# Altium schematic sheet PROB_S7CAS_FPGA_B35.SchDoc
size Tabloid; SheetNumber: 6; SheetTotal: 14; Sheet_Name: Insert name in Document Parameters; Size: 11x17
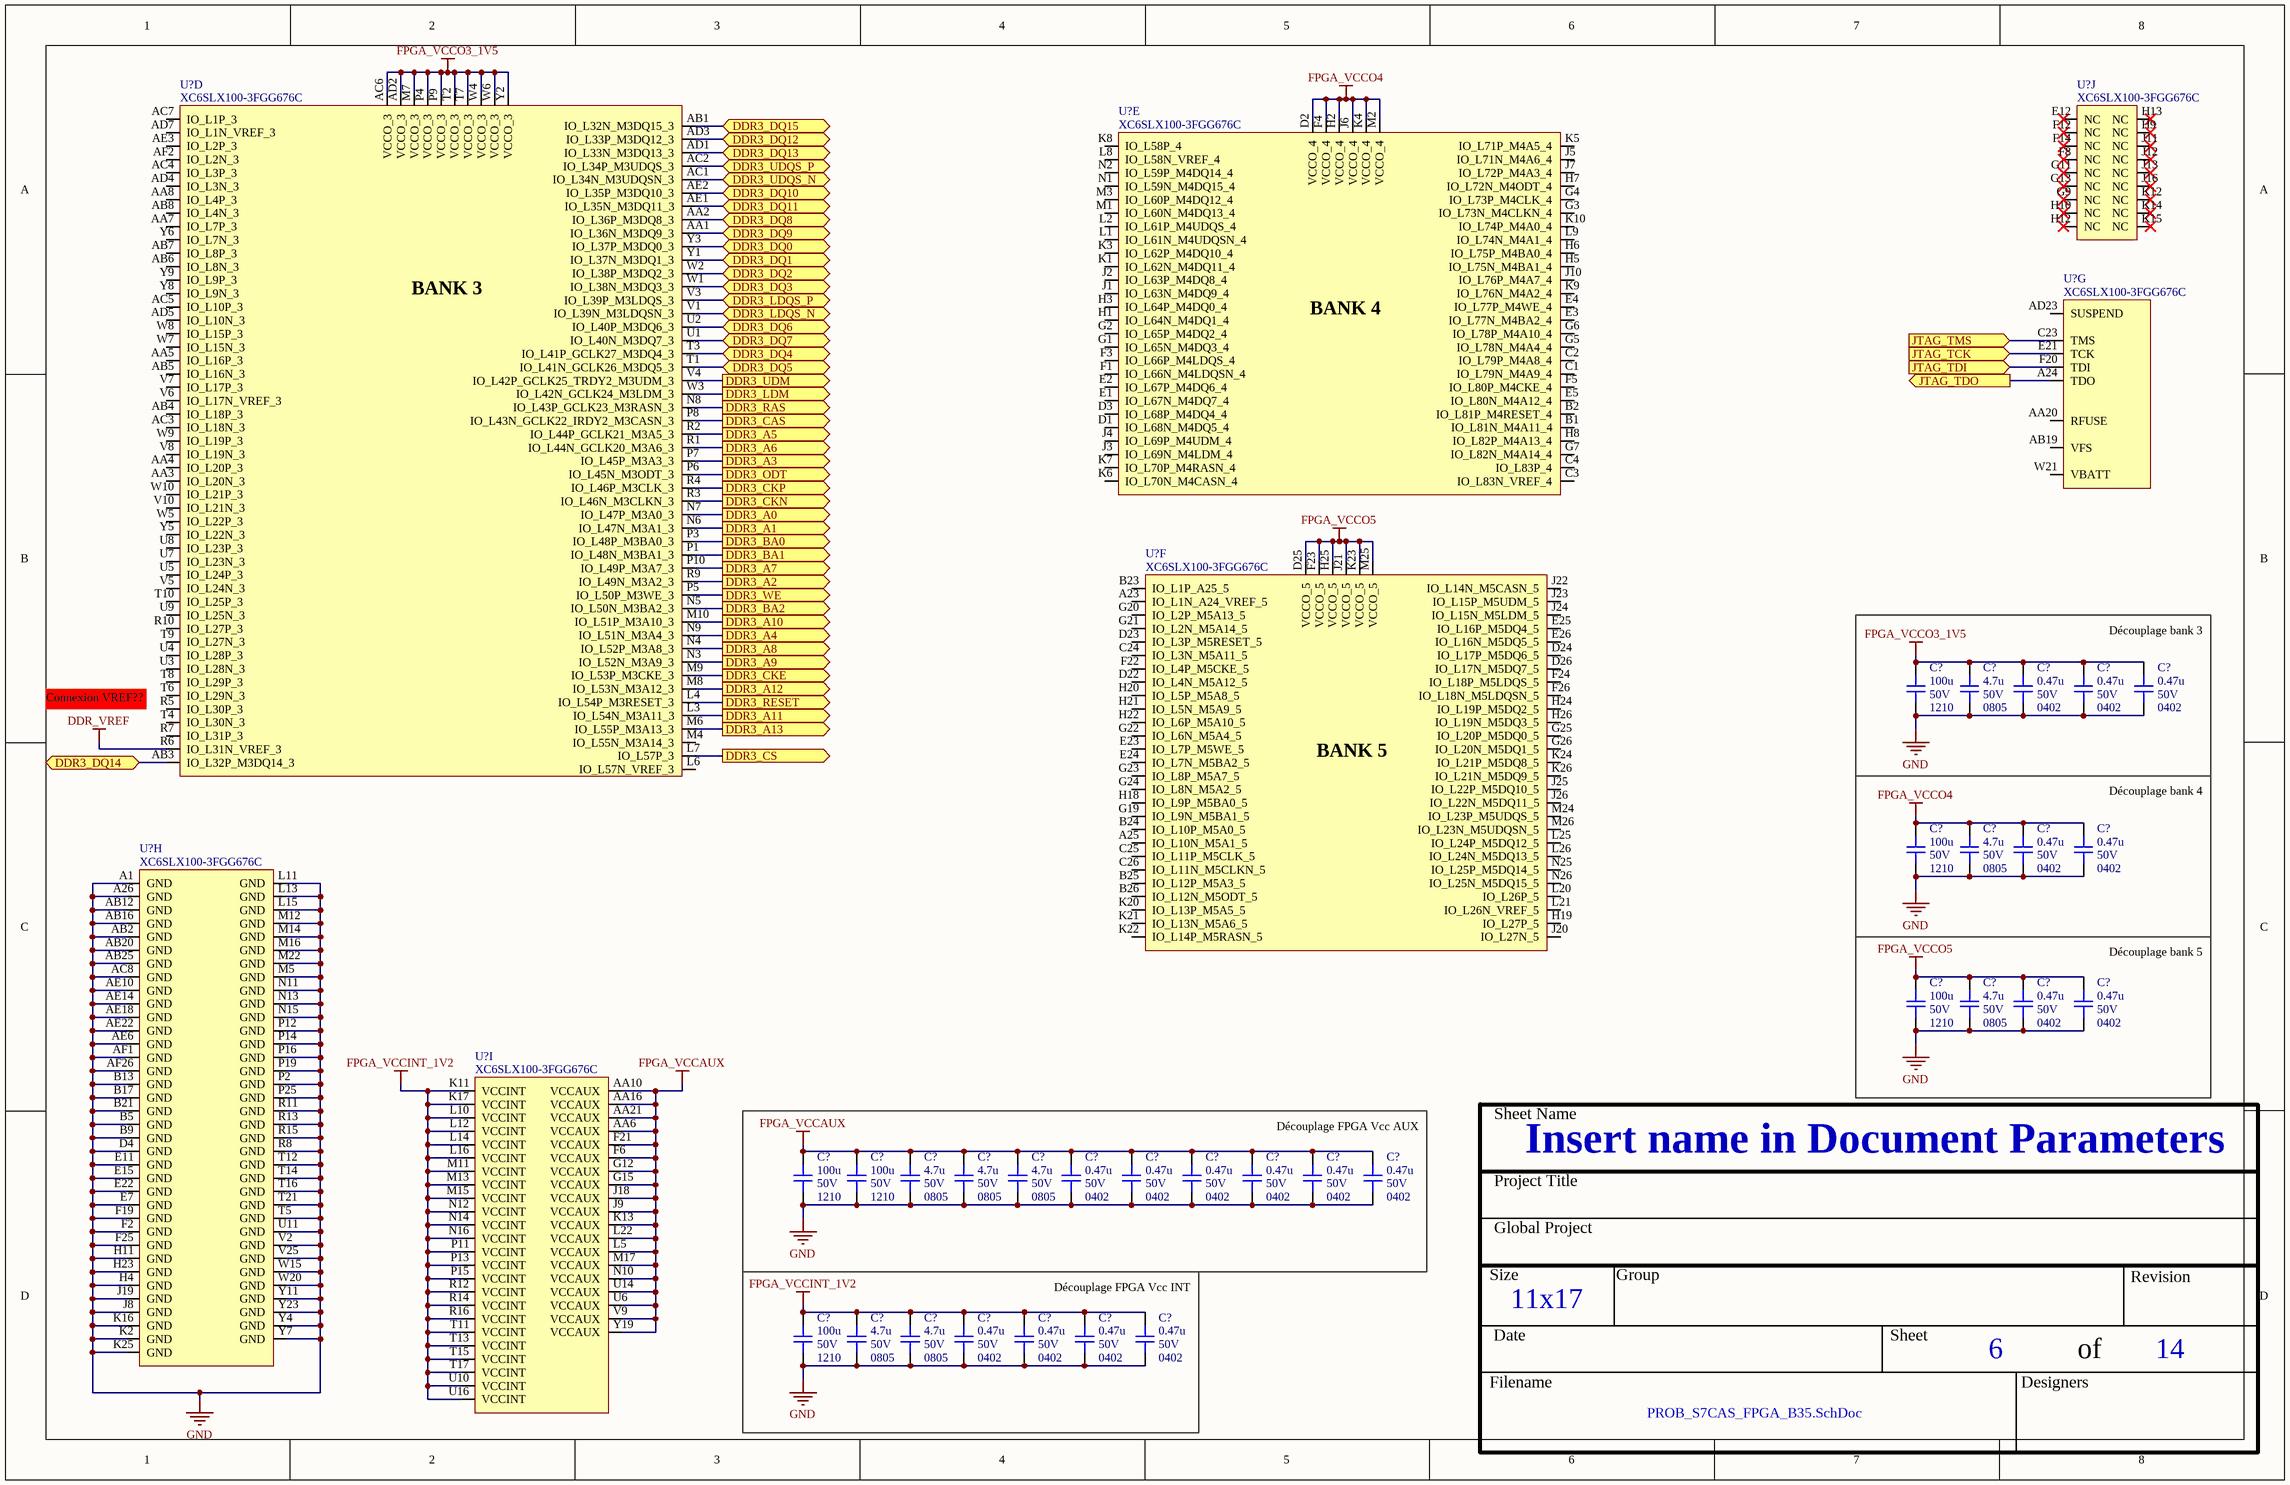
[diagram p0: PROB_S7CAS_FPGA_B35.SchDoc]

## Parts
(Parts that share a designator on the sheet are numbered #1, #2 ... from top to bottom, then left to right.)
C?#1  value 100u  Voltage: 50V  Package: 1210  [CAP_1210]  (hidden comment: CAP - 1210)
C?#2  value 4.7u  Voltage: 50V  Package: 0805  [CAP_0805]  (hidden comment: CAP - 0805)
C?#3  value 0.47u  Voltage: 50V  Package: 0402  [CAP_0402]  (hidden comment: CAP - 0402)
C?#4  value 0.47u  Voltage: 50V  Package: 0402  [CAP_0402]  (hidden comment: CAP - 0402)
C?#5  value 0.47u  Voltage: 50V  Package: 0402  [CAP_0402]  (hidden comment: CAP - 0402)
C?#6  value 100u  Voltage: 50V  Package: 1210  [CAP_1210]  (hidden comment: CAP - 1210)
C?#7  value 4.7u  Voltage: 50V  Package: 0805  [CAP_0805]  (hidden comment: CAP - 0805)
C?#8  value 0.47u  Voltage: 50V  Package: 0402  [CAP_0402]  (hidden comment: CAP - 0402)
C?#9  value 0.47u  Voltage: 50V  Package: 0402  [CAP_0402]  (hidden comment: CAP - 0402)
C?#10  value 100u  Voltage: 50V  Package: 1210  [CAP_1210]  (hidden comment: CAP - 1210)
C?#11  value 4.7u  Voltage: 50V  Package: 0805  [CAP_0805]  (hidden comment: CAP - 0805)
C?#12  value 0.47u  Voltage: 50V  Package: 0402  [CAP_0402]  (hidden comment: CAP - 0402)
C?#13  value 0.47u  Voltage: 50V  Package: 0402  [CAP_0402]  (hidden comment: CAP - 0402)
C?#14  value 100u  Voltage: 50V  Package: 1210  [CAP_1210]  (hidden comment: CAP - 1210)
C?#15  value 100u  Voltage: 50V  Package: 1210  [CAP_1210]  (hidden comment: CAP - 1210)
C?#16  value 4.7u  Voltage: 50V  Package: 0805  [CAP_0805]  (hidden comment: CAP - 0805)
C?#17  value 4.7u  Voltage: 50V  Package: 0805  [CAP_0805]  (hidden comment: CAP - 0805)
C?#18  value 4.7u  Voltage: 50V  Package: 0805  [CAP_0805]  (hidden comment: CAP - 0805)
C?#19  value 0.47u  Voltage: 50V  Package: 0402  [CAP_0402]  (hidden comment: CAP - 0402)
C?#20  value 0.47u  Voltage: 50V  Package: 0402  [CAP_0402]  (hidden comment: CAP - 0402)
C?#21  value 0.47u  Voltage: 50V  Package: 0402  [CAP_0402]  (hidden comment: CAP - 0402)
C?#22  value 0.47u  Voltage: 50V  Package: 0402  [CAP_0402]  (hidden comment: CAP - 0402)
C?#23  value 0.47u  Voltage: 50V  Package: 0402  [CAP_0402]  (hidden comment: CAP - 0402)
C?#24  value 0.47u  Voltage: 50V  Package: 0402  [CAP_0402]  (hidden comment: CAP - 0402)
C?#25  value 100u  Voltage: 50V  Package: 1210  [CAP_1210]  (hidden comment: CAP - 1210)
C?#26  value 4.7u  Voltage: 50V  Package: 0805  [CAP_0805]  (hidden comment: CAP - 0805)
C?#27  value 4.7u  Voltage: 50V  Package: 0805  [CAP_0805]  (hidden comment: CAP - 0805)
C?#28  value 0.47u  Voltage: 50V  Package: 0402  [CAP_0402]  (hidden comment: CAP - 0402)
C?#29  value 0.47u  Voltage: 50V  Package: 0402  [CAP_0402]  (hidden comment: CAP - 0402)
C?#30  value 0.47u  Voltage: 50V  Package: 0402  [CAP_0402]  (hidden comment: CAP - 0402)
C?#31  value 0.47u  Voltage: 50V  Package: 0402  [CAP_0402]  (hidden comment: CAP - 0402)
U?#1  XC6SLX100-3FGG676C  [FPGA_XILINX_FGG676]  (part D of 10)
U?#2  XC6SLX100-3FGG676C  [FPGA_XILINX_FGG676]  (part J of 10)
U?#3  XC6SLX100-3FGG676C  [FPGA_XILINX_FGG676]  (part E of 10)
U?#4  XC6SLX100-3FGG676C  [FPGA_XILINX_FGG676]  (part G of 10)
U?#5  XC6SLX100-3FGG676C  [FPGA_XILINX_FGG676]  (part F of 10)
U?#6  XC6SLX100-3FGG676C  [FPGA_XILINX_FGG676]  (part H of 10)
U?#7  XC6SLX100-3FGG676C  [FPGA_XILINX_FGG676]  (part I of 10)

## Ports
DDR3_A0 (out), DDR3_A1 (out), DDR3_A2 (out), DDR3_A3 (out), DDR3_A4 (out), DDR3_A5 (out), DDR3_A6 (out), DDR3_A7 (out), DDR3_A8 (out), DDR3_A9 (out), DDR3_A10 (out), DDR3_A11 (out), DDR3_A12 (out), DDR3_A13 (out), DDR3_BA0 (out), DDR3_BA1 (out), DDR3_BA2 (out), DDR3_CAS (out), DDR3_CKE (out), DDR3_CKN (out), DDR3_CKP (out), DDR3_CS (out), DDR3_DQ0 (bidir), DDR3_DQ1 (bidir), DDR3_DQ2 (bidir), DDR3_DQ3 (bidir), DDR3_DQ4 (bidir), DDR3_DQ5 (bidir), DDR3_DQ6 (bidir), DDR3_DQ7 (bidir), DDR3_DQ8 (bidir), DDR3_DQ9 (bidir), DDR3_DQ10 (bidir), DDR3_DQ11 (bidir), DDR3_DQ12 (bidir), DDR3_DQ13 (bidir), DDR3_DQ14 (bidir), DDR3_DQ15 (bidir), DDR3_LDM (out), DDR3_LDQS_N (bidir), DDR3_LDQS_P (bidir), DDR3_ODT (out), DDR3_RAS (out), DDR3_RESET (out), DDR3_UDM (out), DDR3_UDQS_N (bidir), DDR3_UDQS_P (bidir), DDR3_WE (out), JTAG_TCK (in), JTAG_TDI (in), JTAG_TDO (out), JTAG_TMS (in)

## Nets
DDR_VREF: U?#1.R6(IO_L31N_VREF_3)
FPGA_VCCAUX: C?#14.2 C?#15.2 C?#16.2 C?#17.2 C?#18.2 C?#19.2 C?#20.2 C?#21.2 C?#22.2 C?#23.2 C?#24.2 U?#7.AA6(VCCAUX) U?#7.AA10(VCCAUX) U?#7.AA16(VCCAUX) U?#7.AA21(VCCAUX) U?#7.F6(VCCAUX) U?#7.F21(VCCAUX) U?#7.G12(VCCAUX) U?#7.G15(VCCAUX) U?#7.J9(VCCAUX) U?#7.J18(VCCAUX) U?#7.K13(VCCAUX) U?#7.L5(VCCAUX) U?#7.L22(VCCAUX) U?#7.M17(VCCAUX) U?#7.N10(VCCAUX) U?#7.U6(VCCAUX) U?#7.U14(VCCAUX) U?#7.V9(VCCAUX) U?#7.Y19(VCCAUX)
FPGA_VCCINT_1V2: C?#25.2 C?#26.2 C?#27.2 C?#28.2 C?#29.2 C?#30.2 C?#31.2 U?#7.K11(VCCINT) U?#7.K17(VCCINT) U?#7.L10(VCCINT) U?#7.L12(VCCINT) U?#7.L14(VCCINT) U?#7.L16(VCCINT) U?#7.M11(VCCINT) U?#7.M13(VCCINT) U?#7.M15(VCCINT) U?#7.N12(VCCINT) U?#7.N14(VCCINT) U?#7.N16(VCCINT) U?#7.P11(VCCINT) U?#7.P13(VCCINT) U?#7.P15(VCCINT) U?#7.R12(VCCINT) U?#7.R14(VCCINT) U?#7.R16(VCCINT) U?#7.T11(VCCINT) U?#7.T13(VCCINT) U?#7.T15(VCCINT) U?#7.T17(VCCINT) U?#7.U10(VCCINT) U?#7.U16(VCCINT)
FPGA_VCCO3_1V5: C?#1.2 C?#2.2 C?#3.2 C?#4.2 C?#5.2 U?#1.AC6(VCCO_3) U?#1.AD2(VCCO_3) U?#1.M7(VCCO_3) U?#1.P4(VCCO_3) U?#1.P9(VCCO_3) U?#1.T2(VCCO_3) U?#1.T7(VCCO_3) U?#1.W4(VCCO_3) U?#1.W6(VCCO_3) U?#1.Y2(VCCO_3)
FPGA_VCCO4: C?#6.2 C?#7.2 C?#8.2 C?#9.2 U?#3.D2(VCCO_4) U?#3.F4(VCCO_4) U?#3.H2(VCCO_4) U?#3.J6(VCCO_4) U?#3.K4(VCCO_4) U?#3.M2(VCCO_4)
FPGA_VCCO5: C?#10.2 C?#11.2 C?#12.2 C?#13.2 U?#5.D25(VCCO_5) U?#5.F23(VCCO_5) U?#5.H25(VCCO_5) U?#5.J21(VCCO_5) U?#5.K23(VCCO_5) U?#5.M25(VCCO_5)
GND: C?#1.1 C?#2.1 C?#3.1 C?#4.1 C?#5.1 C?#6.1 C?#7.1 C?#8.1 C?#9.1 C?#10.1 C?#11.1 C?#12.1 C?#13.1 C?#14.1 C?#15.1 C?#16.1 C?#17.1 C?#18.1 C?#19.1 C?#20.1 C?#21.1 C?#22.1 C?#23.1 C?#24.1 C?#25.1 C?#26.1 C?#27.1 C?#28.1 C?#29.1 C?#30.1 C?#31.1 U?#6.A1(GND) U?#6.A26(GND) U?#6.AB2(GND) U?#6.AB12(GND) U?#6.AB16(GND) U?#6.AB20(GND) U?#6.AB25(GND) U?#6.AC8(GND) U?#6.AE6(GND) U?#6.AE10(GND) U?#6.AE14(GND) U?#6.AE18(GND) U?#6.AE22(GND) U?#6.AF1(GND) U?#6.AF26(GND) U?#6.B5(GND) U?#6.B9(GND) U?#6.B13(GND) U?#6.B17(GND) U?#6.B21(GND) U?#6.D4(GND) U?#6.E7(GND) U?#6.E11(GND) U?#6.E15(GND) U?#6.E22(GND) U?#6.F2(GND) U?#6.F19(GND) U?#6.F25(GND) U?#6.H4(GND) U?#6.H11(GND) U?#6.H23(GND) U?#6.J8(GND) U?#6.J19(GND) U?#6.K2(GND) U?#6.K16(GND) U?#6.K25(GND) U?#6.L11(GND) U?#6.L13(GND) U?#6.L15(GND) U?#6.M5(GND) U?#6.M12(GND) U?#6.M14(GND) U?#6.M16(GND) U?#6.M22(GND) U?#6.N11(GND) U?#6.N13(GND) U?#6.N15(GND) U?#6.P2(GND) U?#6.P12(GND) U?#6.P14(GND) U?#6.P16(GND) U?#6.P19(GND) U?#6.P25(GND) U?#6.R8(GND) U?#6.R11(GND) U?#6.R13(GND) U?#6.R15(GND) U?#6.T5(GND) U?#6.T12(GND) U?#6.T14(GND) U?#6.T16(GND) U?#6.T21(GND) U?#6.U11(GND) U?#6.V2(GND) U?#6.V25(GND) U?#6.W15(GND) U?#6.W20(GND) U?#6.Y4(GND) U?#6.Y7(GND) U?#6.Y11(GND) U?#6.Y23(GND)
DDR3_A0: U?#1.N7(IO_L47P_M3A0_3) ; port DDR3_A0
DDR3_A1: U?#1.N6(IO_L47N_M3A1_3) ; port DDR3_A1
DDR3_A2: U?#1.R9(IO_L49N_M3A2_3) ; port DDR3_A2
DDR3_A3: U?#1.P7(IO_L45P_M3A3_3) ; port DDR3_A3
DDR3_A4: U?#1.N9(IO_L51N_M3A4_3) ; port DDR3_A4
DDR3_A5: U?#1.R2(IO_L44P_GCLK21_M3A5_3) ; port DDR3_A5
DDR3_A6: U?#1.R1(IO_L44N_GCLK20_M3A6_3) ; port DDR3_A6
DDR3_A7: U?#1.P10(IO_L49P_M3A7_3) ; port DDR3_A7
DDR3_A8: U?#1.N4(IO_L52P_M3A8_3) ; port DDR3_A8
DDR3_A9: U?#1.N3(IO_L52N_M3A9_3) ; port DDR3_A9
DDR3_A10: U?#1.M10(IO_L51P_M3A10_3) ; port DDR3_A10
DDR3_A11: U?#1.L3(IO_L54N_M3A11_3) ; port DDR3_A11
DDR3_A12: U?#1.M8(IO_L53N_M3A12_3) ; port DDR3_A12
DDR3_A13: U?#1.M6(IO_L55P_M3A13_3) ; port DDR3_A13
DDR3_BA0: U?#1.P3(IO_L48P_M3BA0_3) ; port DDR3_BA0
DDR3_BA1: U?#1.P1(IO_L48N_M3BA1_3) ; port DDR3_BA1
DDR3_BA2: U?#1.N5(IO_L50N_M3BA2_3) ; port DDR3_BA2
DDR3_CAS: U?#1.P8(IO_L43N_GCLK22_IRDY2_M3CASN_3) ; port DDR3_CAS
DDR3_CKE: U?#1.M9(IO_L53P_M3CKE_3) ; port DDR3_CKE
DDR3_CKN: U?#1.R3(IO_L46N_M3CLKN_3) ; port DDR3_CKN
DDR3_CKP: U?#1.R4(IO_L46P_M3CLK_3) ; port DDR3_CKP
DDR3_CS: U?#1.L7(IO_L57P_3) ; port DDR3_CS
DDR3_DQ0: U?#1.Y3(IO_L37P_M3DQ0_3) ; port DDR3_DQ0
DDR3_DQ1: U?#1.Y1(IO_L37N_M3DQ1_3) ; port DDR3_DQ1
DDR3_DQ2: U?#1.W2(IO_L38P_M3DQ2_3) ; port DDR3_DQ2
DDR3_DQ3: U?#1.W1(IO_L38N_M3DQ3_3) ; port DDR3_DQ3
DDR3_DQ4: U?#1.T3(IO_L41P_GCLK27_M3DQ4_3) ; port DDR3_DQ4
DDR3_DQ5: U?#1.T1(IO_L41N_GCLK26_M3DQ5_3) ; port DDR3_DQ5
DDR3_DQ6: U?#1.U2(IO_L40P_M3DQ6_3) ; port DDR3_DQ6
DDR3_DQ7: U?#1.U1(IO_L40N_M3DQ7_3) ; port DDR3_DQ7
DDR3_DQ8: U?#1.AA2(IO_L36P_M3DQ8_3) ; port DDR3_DQ8
DDR3_DQ9: U?#1.AA1(IO_L36N_M3DQ9_3) ; port DDR3_DQ9
DDR3_DQ10: U?#1.AE2(IO_L35P_M3DQ10_3) ; port DDR3_DQ10
DDR3_DQ11: U?#1.AE1(IO_L35N_M3DQ11_3) ; port DDR3_DQ11
DDR3_DQ12: U?#1.AD3(IO_L33P_M3DQ12_3) ; port DDR3_DQ12
DDR3_DQ13: U?#1.AD1(IO_L33N_M3DQ13_3) ; port DDR3_DQ13
DDR3_DQ14: U?#1.AB3(IO_L32P_M3DQ14_3) ; port DDR3_DQ14
DDR3_DQ15: U?#1.AB1(IO_L32N_M3DQ15_3) ; port DDR3_DQ15
DDR3_LDM: U?#1.W3(IO_L42N_GCLK24_M3LDM_3) ; port DDR3_LDM
DDR3_LDQS_N: U?#1.V1(IO_L39N_M3LDQSN_3) ; port DDR3_LDQS_N
DDR3_LDQS_P: U?#1.V3(IO_L39P_M3LDQS_3) ; port DDR3_LDQS_P
DDR3_ODT: U?#1.P6(IO_L45N_M3ODT_3) ; port DDR3_ODT
DDR3_RAS: U?#1.N8(IO_L43P_GCLK23_M3RASN_3) ; port DDR3_RAS
DDR3_RESET: U?#1.L4(IO_L54P_M3RESET_3) ; port DDR3_RESET
DDR3_UDM: U?#1.V4(IO_L42P_GCLK25_TRDY2_M3UDM_3) ; port DDR3_UDM
DDR3_UDQS_N: U?#1.AC1(IO_L34N_M3UDQSN_3) ; port DDR3_UDQS_N
DDR3_UDQS_P: U?#1.AC2(IO_L34P_M3UDQS_3) ; port DDR3_UDQS_P
DDR3_WE: U?#1.P5(IO_L50P_M3WE_3) ; port DDR3_WE
JTAG_TCK: U?#4.E21(TCK) ; port JTAG_TCK
JTAG_TDI: U?#4.F20(TDI) ; port JTAG_TDI
JTAG_TDO: U?#4.A24(TDO) ; port JTAG_TDO
JTAG_TMS: U?#4.C23(TMS) ; port JTAG_TMS

Not connected (* = marked no-connect by the designer): U?#1 AA3(IO_L20N_3) AA4(IO_L20P_3) AA5(IO_L16P_3) AA7(IO_L7P_3) AA8(IO_L4P_3) AB4(IO_L18P_3) AB5(IO_L16N_3) AB6(IO_L8N_3) AB7(IO_L8P_3) AB8(IO_L4N_3) AC3(IO_L18N_3) AC4(IO_L3P_3) AC5(IO_L10P_3) AC7(IO_L1P_3) AD4(IO_L3N_3) AD5(IO_L10N_3) AD7(IO_L1N_VREF_3) AE3(IO_L2P_3) AF2(IO_L2N_3) L6(IO_L57N_VREF_3) M4(IO_L55N_M3A14_3) R5(IO_L30P_3) R7(IO_L31P_3) R10(IO_L27P_3) T4(IO_L30N_3) T6(IO_L29N_3) T8(IO_L29P_3) T9(IO_L27N_3) T10(IO_L25P_3) U3(IO_L28N_3) U4(IO_L28P_3) U5(IO_L24P_3) U7(IO_L23N_3) U8(IO_L23P_3) U9(IO_L25N_3) V5(IO_L24N_3) V6(IO_L17N_VREF_3) V7(IO_L17P_3) V8(IO_L19N_3) V10(IO_L21N_3) W5(IO_L22P_3) W7(IO_L15N_3) W8(IO_L15P_3) W9(IO_L19P_3) W10(IO_L21P_3) Y5(IO_L22N_3) Y6(IO_L7N_3) Y8(IO_L9N_3) Y9(IO_L9P_3); U?#2 E12(NC)* F8(NC)* F12(NC)* F14(NC)* G9(NC)* G11(NC)* G13(NC)* H9(NC)* H10(NC)* H12(NC)* H13(NC)* J11(NC)* J12(NC)* J13(NC)* J16(NC)* K12(NC)* K14(NC)* K15(NC)*; U?#3 B1(IO_L81N_M4A11_4) B2(IO_L81P_M4RESET_4) C1(IO_L79N_M4A9_4) C2(IO_L79P_M4A8_4) C3(IO_L83N_VREF_4) C4(IO_L83P_4) D1(IO_L68N_M4DQ5_4) D3(IO_L68P_M4DQ4_4) E1(IO_L67N_M4DQ7_4) E2(IO_L67P_M4DQ6_4) E3(IO_L77N_M4BA2_4) E4(IO_L77P_M4WE_4) E5(IO_L80N_M4A12_4) F1(IO_L66N_M4LDQSN_4) F3(IO_L66P_M4LDQS_4) F5(IO_L80P_M4CKE_4) G1(IO_L65N_M4DQ3_4) G2(IO_L65P_M4DQ2_4) G3(IO_L73N_M4CLKN_4) G4(IO_L73P_M4CLK_4) G5(IO_L78N_M4A4_4) G6(IO_L78P_M4A10_4) G7(IO_L82N_M4A14_4) H1(IO_L64N_M4DQ1_4) H3(IO_L64P_M4DQ0_4) H5(IO_L75N_M4BA1_4) H6(IO_L75P_M4BA0_4) H7(IO_L72N_M4ODT_4) H8(IO_L82P_M4A13_4) J1(IO_L63N_M4DQ9_4) J2(IO_L63P_M4DQ8_4) J3(IO_L69N_M4LDM_4) J4(IO_L69P_M4UDM_4) J5(IO_L71N_M4A6_4) J7(IO_L72P_M4A3_4) J10(IO_L76P_M4A7_4) K1(IO_L62N_M4DQ11_4) K3(IO_L62P_M4DQ10_4) K5(IO_L71P_M4A5_4) K6(IO_L70N_M4CASN_4) K7(IO_L70P_M4RASN_4) K8(IO_L58P_4) K9(IO_L76N_M4A2_4) K10(IO_L74P_M4A0_4) L1(IO_L61N_M4UDQSN_4) L2(IO_L61P_M4UDQS_4) L8(IO_L58N_VREF_4) L9(IO_L74N_M4A1_4) M1(IO_L60N_M4DQ13_4) M3(IO_L60P_M4DQ12_4) N1(IO_L59N_M4DQ15_4) N2(IO_L59P_M4DQ14_4); U?#4 AA20(RFUSE) AB19(VFS) AD23(SUSPEND) W21(VBATT); U?#5 A23(IO_L1N_A24_VREF_5) A25(IO_L10N_M5A1_5) B23(IO_L1P_A25_5) B24(IO_L10P_M5A0_5) B25(IO_L12P_M5A3_5) B26(IO_L12N_M5ODT_5) C24(IO_L3N_M5A11_5) C25(IO_L11P_M5CLK_5) C26(IO_L11N_M5CLKN_5) D22(IO_L4N_M5A12_5) D23(IO_L3P_M5RESET_5) D24(IO_L17P_M5DQ6_5) D26(IO_L17N_M5DQ7_5) E23(IO_L7P_M5WE_5) E24(IO_L7N_M5BA2_5) E25(IO_L16P_M5DQ4_5) E26(IO_L16N_M5DQ5_5) F22(IO_L4P_M5CKE_5) F24(IO_L18P_M5LDQS_5) F26(IO_L18N_M5LDQSN_5) G19(IO_L9N_M5BA1_5) G20(IO_L2P_M5A13_5) G21(IO_L2N_M5A14_5) G22(IO_L6N_M5A4_5) G23(IO_L8P_M5A7_5) G24(IO_L8N_M5A2_5) G25(IO_L20P_M5DQ0_5) G26(IO_L20N_M5DQ1_5) H18(IO_L9P_M5BA0_5) H19(IO_L27P_5) H20(IO_L5P_M5A8_5) H21(IO_L5N_M5A9_5) H22(IO_L6P_M5A10_5) H24(IO_L19P_M5DQ2_5) H26(IO_L19N_M5DQ3_5) J20(IO_L27N_5) J22(IO_L14N_M5CASN_5) J23(IO_L15P_M5UDM_5) J24(IO_L15N_M5LDM_5) J25(IO_L22P_M5DQ10_5) J26(IO_L22N_M5DQ11_5) K20(IO_L13P_M5A5_5) K21(IO_L13N_M5A6_5) K22(IO_L14P_M5RASN_5) K24(IO_L21P_M5DQ8_5) K26(IO_L21N_M5DQ9_5) L20(IO_L26P_5) L21(IO_L26N_VREF_5) L25(IO_L24P_M5DQ12_5) L26(IO_L24N_M5DQ13_5) M24(IO_L23P_M5UDQS_5) M26(IO_L23N_M5UDQSN_5) N25(IO_L25P_M5DQ14_5) N26(IO_L25N_M5DQ15_5)

## Notes on the sheet
- (near U?#1) Connexion VREF??
- (near C?#4) Découplage bank 3
- (near C?#9) Découplage bank 4
- (near C?#13) Découplage bank 5
- (near C?#23) Découplage FPGA Vcc AUX
- (near C?#30) Découplage FPGA Vcc INT
- Sheet Name
- Project Title
- Global Project
- Size
- Group
- Revision
- Date
- Sheet
- of
- Filename
- Designers
- (in symbol FPGA_XC6SLX100-3FGG676C, part D) BANK 3
- (in symbol FPGA_XC6SLX100-3FGG676C, part E) BANK 4
- (in symbol FPGA_XC6SLX100-3FGG676C, part F) BANK 5

## Library data of the parts
C?#1 C?#6 C?#10 C?#14 C?#15 C?#25 = CAP - 1210: Precision: 10%; Current: *; CreatedBy: Jonathan Bouchard
C?#2 C?#7 C?#11 C?#16-C?#18 C?#26 C?#27 = CAP - 0805: Precision: 10%; Current: *; CreatedBy: Jonathan Bouchard; Power: *
C?#3-C?#5 C?#8 C?#9 C?#12 C?#13 C?#19-C?#24 C?#28-C?#31 = CAP - 0402: Precision: 10%; Current: *; CreatedBy: Jonathan Bouchard; Power: *
U?#1-U?#7 = FPGA_XC6SLX100-3FGG676C: FPGA - XILINX SPARTAN 6 480 I/O - BGA-676; Voltage: 1.14 V ~ 1.26 V; Current: *; Power: *; Mfg: Xilinx; Mfg Part Number: XC6SLX100-3FGG676C; HelpURL: https://www.xilinx.com/support/documentation/data_sheets/ds162.pdf; CreatedBy: Jonathan Bouchard; Temperature: 0°C ~ 85°C (TJ); Value: *; Precision: *; Package: BGA-676; Supplier 1: Digikey; Supplier Part Number 1: 122-1760-ND